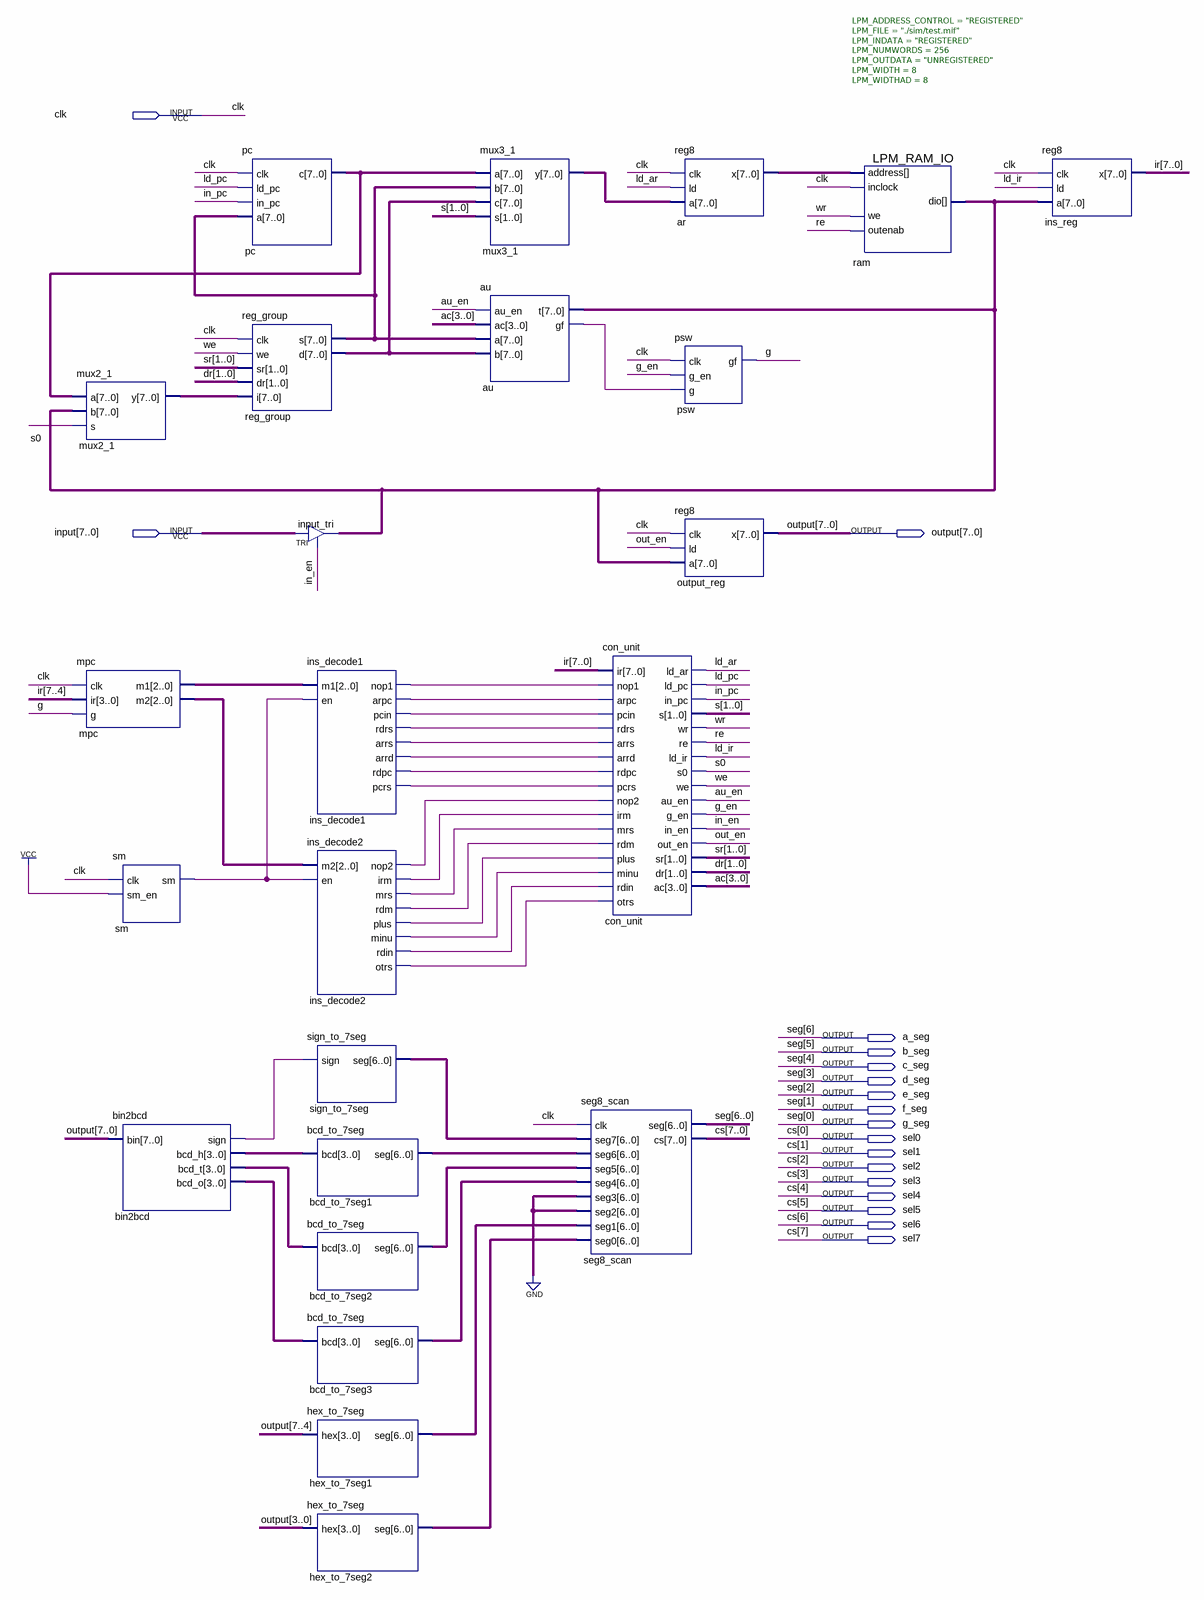
[diagram p0: schematic sheet]
// Quartus schematic cpu.bdf as structural Verilog: 24 symbols, 18 pins
module cpu (
  input  clk,
  input  [7:0] \input ,
  output [7:0] \output ,
  output a_seg,
  output b_seg,
  output c_seg,
  output d_seg,
  output e_seg,
  output f_seg,
  output g_seg,
  output sel0,
  output sel1,
  output sel2,
  output sel3,
  output sel4,
  output sel5,
  output sel6,
  output sel7
);

  wire au_en, au_gf, bin2bcd_sign, g, g_en, in_en, in_pc, ins_decode1_arpc, ins_decode1_arrd,
       ins_decode1_arrs, ins_decode1_nop1, ins_decode1_pcin, ins_decode1_pcrs, ins_decode1_rdpc,
       ins_decode1_rdrs, ins_decode2_irm, ins_decode2_minu, ins_decode2_mrs, ins_decode2_nop2,
       ins_decode2_otrs, ins_decode2_plus, ins_decode2_rdin, ins_decode2_rdm, ld_ar, ld_ir, ld_pc, out_en,
       re, sm_sm, we, wr;
  wire [1:0] dr, s, sr;
  wire [2:0] mpc_m1, mpc_m2;
  wire [3:0] ac, bin2bcd_bcd_h, bin2bcd_bcd_o, bin2bcd_bcd_t;
  wire [6:0] bcd_to_7seg1_seg, bcd_to_7seg2_seg, bcd_to_7seg3_seg, hex_to_7seg1_seg, hex_to_7seg2_seg,
       sign_to_7seg_seg;
  wire [7:0] ar_x, input_tri_out, ir, mux2_1_y, mux3_1_y, pc_c, reg_group_d, reg_group_s;

  mux2_1 mux2_1 (.a(pc_c), .b(input_tri_out), .s(s[0]), .y(mux2_1_y));
  mpc mpc (.clk(clk), .ir(ir[7:4]), .g(g), .m1(mpc_m1), .m2(mpc_m2));
  sm sm (.clk(clk), .sm_en(1'b1), .sm(sm_sm));
  bin2bcd bin2bcd (
    .bin(\output ), .sign(bin2bcd_sign), .bcd_h(bin2bcd_bcd_h), .bcd_t(bin2bcd_bcd_t), .bcd_o(bin2bcd_bcd_o));
  pc pc (.clk(clk), .ld_pc(ld_pc), .in_pc(in_pc), .a(reg_group_s), .c(pc_c));
  reg_group reg_group (.clk(clk), .we(we), .sr(sr), .dr(dr), .i(mux2_1_y), .s(reg_group_s), .d(reg_group_d));
  TRI input_tri[7:0] (.IN(\input ), .OE(in_en), .OUT(input_tri_out));
  ins_decode1 ins_decode1 (
    .m1(mpc_m1), .en(sm_sm), .nop1(ins_decode1_nop1), .arpc(ins_decode1_arpc), .pcin(ins_decode1_pcin),
    .rdrs(ins_decode1_rdrs), .arrs(ins_decode1_arrs), .arrd(ins_decode1_arrd), .rdpc(ins_decode1_rdpc),
    .pcrs(ins_decode1_pcrs));
  ins_decode2 ins_decode2 (
    .m2(mpc_m2), .en(sm_sm), .nop2(ins_decode2_nop2), .irm(ins_decode2_irm), .mrs(ins_decode2_mrs),
    .rdm(ins_decode2_rdm), .plus(ins_decode2_plus), .minu(ins_decode2_minu), .rdin(ins_decode2_rdin),
    .otrs(ins_decode2_otrs));
  sign_to_7seg sign_to_7seg (.sign(bin2bcd_sign), .seg(sign_to_7seg_seg));
  bcd_to_7seg bcd_to_7seg1 (.bcd(bin2bcd_bcd_h), .seg(bcd_to_7seg1_seg));
  bcd_to_7seg bcd_to_7seg2 (.bcd(bin2bcd_bcd_t), .seg(bcd_to_7seg2_seg));
  bcd_to_7seg bcd_to_7seg3 (.bcd(bin2bcd_bcd_o), .seg(bcd_to_7seg3_seg));
  hex_to_7seg hex_to_7seg1 (.hex(\output [7:4]), .seg(hex_to_7seg1_seg));
  hex_to_7seg hex_to_7seg2 (.hex(\output [3:0]), .seg(hex_to_7seg2_seg));
  mux3_1 mux3_1 (.a(pc_c), .b(reg_group_s), .c(reg_group_d), .s(s), .y(mux3_1_y));
  au au (.au_en(au_en), .ac(ac), .a(reg_group_s), .b(reg_group_d), .t(input_tri_out), .gf(au_gf));
  seg8_scan seg8_scan (
    .clk(clk), .seg7(sign_to_7seg_seg), .seg6(bcd_to_7seg1_seg), .seg5(bcd_to_7seg2_seg),
    .seg4(bcd_to_7seg3_seg), .seg3({7{1'b0}}), .seg2({7{1'b0}}), .seg1(hex_to_7seg1_seg),
    .seg0(hex_to_7seg2_seg), .seg({a_seg, b_seg, c_seg, d_seg, e_seg, f_seg, g_seg}),
    .cs({sel7, sel6, sel5, sel4, sel3, sel2, sel1, sel0}));
  con_unit con_unit (
    .ir(ir), .nop1(ins_decode1_nop1), .arpc(ins_decode1_arpc), .pcin(ins_decode1_pcin),
    .rdrs(ins_decode1_rdrs), .arrs(ins_decode1_arrs), .arrd(ins_decode1_arrd), .rdpc(ins_decode1_rdpc),
    .pcrs(ins_decode1_pcrs), .nop2(ins_decode2_nop2), .irm(ins_decode2_irm), .mrs(ins_decode2_mrs),
    .rdm(ins_decode2_rdm), .plus(ins_decode2_plus), .minu(ins_decode2_minu), .rdin(ins_decode2_rdin),
    .otrs(ins_decode2_otrs), .ld_ar(ld_ar), .ld_pc(ld_pc), .in_pc(in_pc), .s(s), .wr(wr), .re(re),
    .ld_ir(ld_ir), .s0(s[0]), .we(we), .au_en(au_en), .g_en(g_en), .in_en(in_en), .out_en(out_en), .sr(sr),
    .dr(dr), .ac(ac));
  reg8 ar (.clk(clk), .ld(ld_ar), .a(mux3_1_y), .x(ar_x));
  psw psw (.clk(clk), .g_en(g_en), .g(au_gf), .gf(g));
  reg8 output_reg (.clk(clk), .ld(out_en), .a(input_tri_out), .x(\output ));
  LPM_RAM_IO #(.LPM_ADDRESS_CONTROL("REGISTERED"), .LPM_FILE("./sim/test.mif"), .LPM_INDATA("REGISTERED"), .LPM_NUMWORDS(256), .LPM_OUTDATA("UNREGISTERED"), .LPM_WIDTH(8), .LPM_WIDTHAD(8)) ram (
    .address(ar_x), .inclock(clk), .we(wr), .outenab(re), .dio(input_tri_out));
  reg8 ins_reg (.clk(clk), .ld(ld_ir), .a(input_tri_out), .x(ir));

  // Other names for the same wires on the sheet: cs[7:0] = {sel7, sel6, sel5, sel4, sel3, sel2, sel1, sel0};
  //   seg[6:0] = {a_seg, b_seg, c_seg, d_seg, e_seg, f_seg, g_seg}
endmodule
